# Altium schematic sheet Sensor.SchDoc
size A3; SheetNumber: 15; SheetTotal: 15
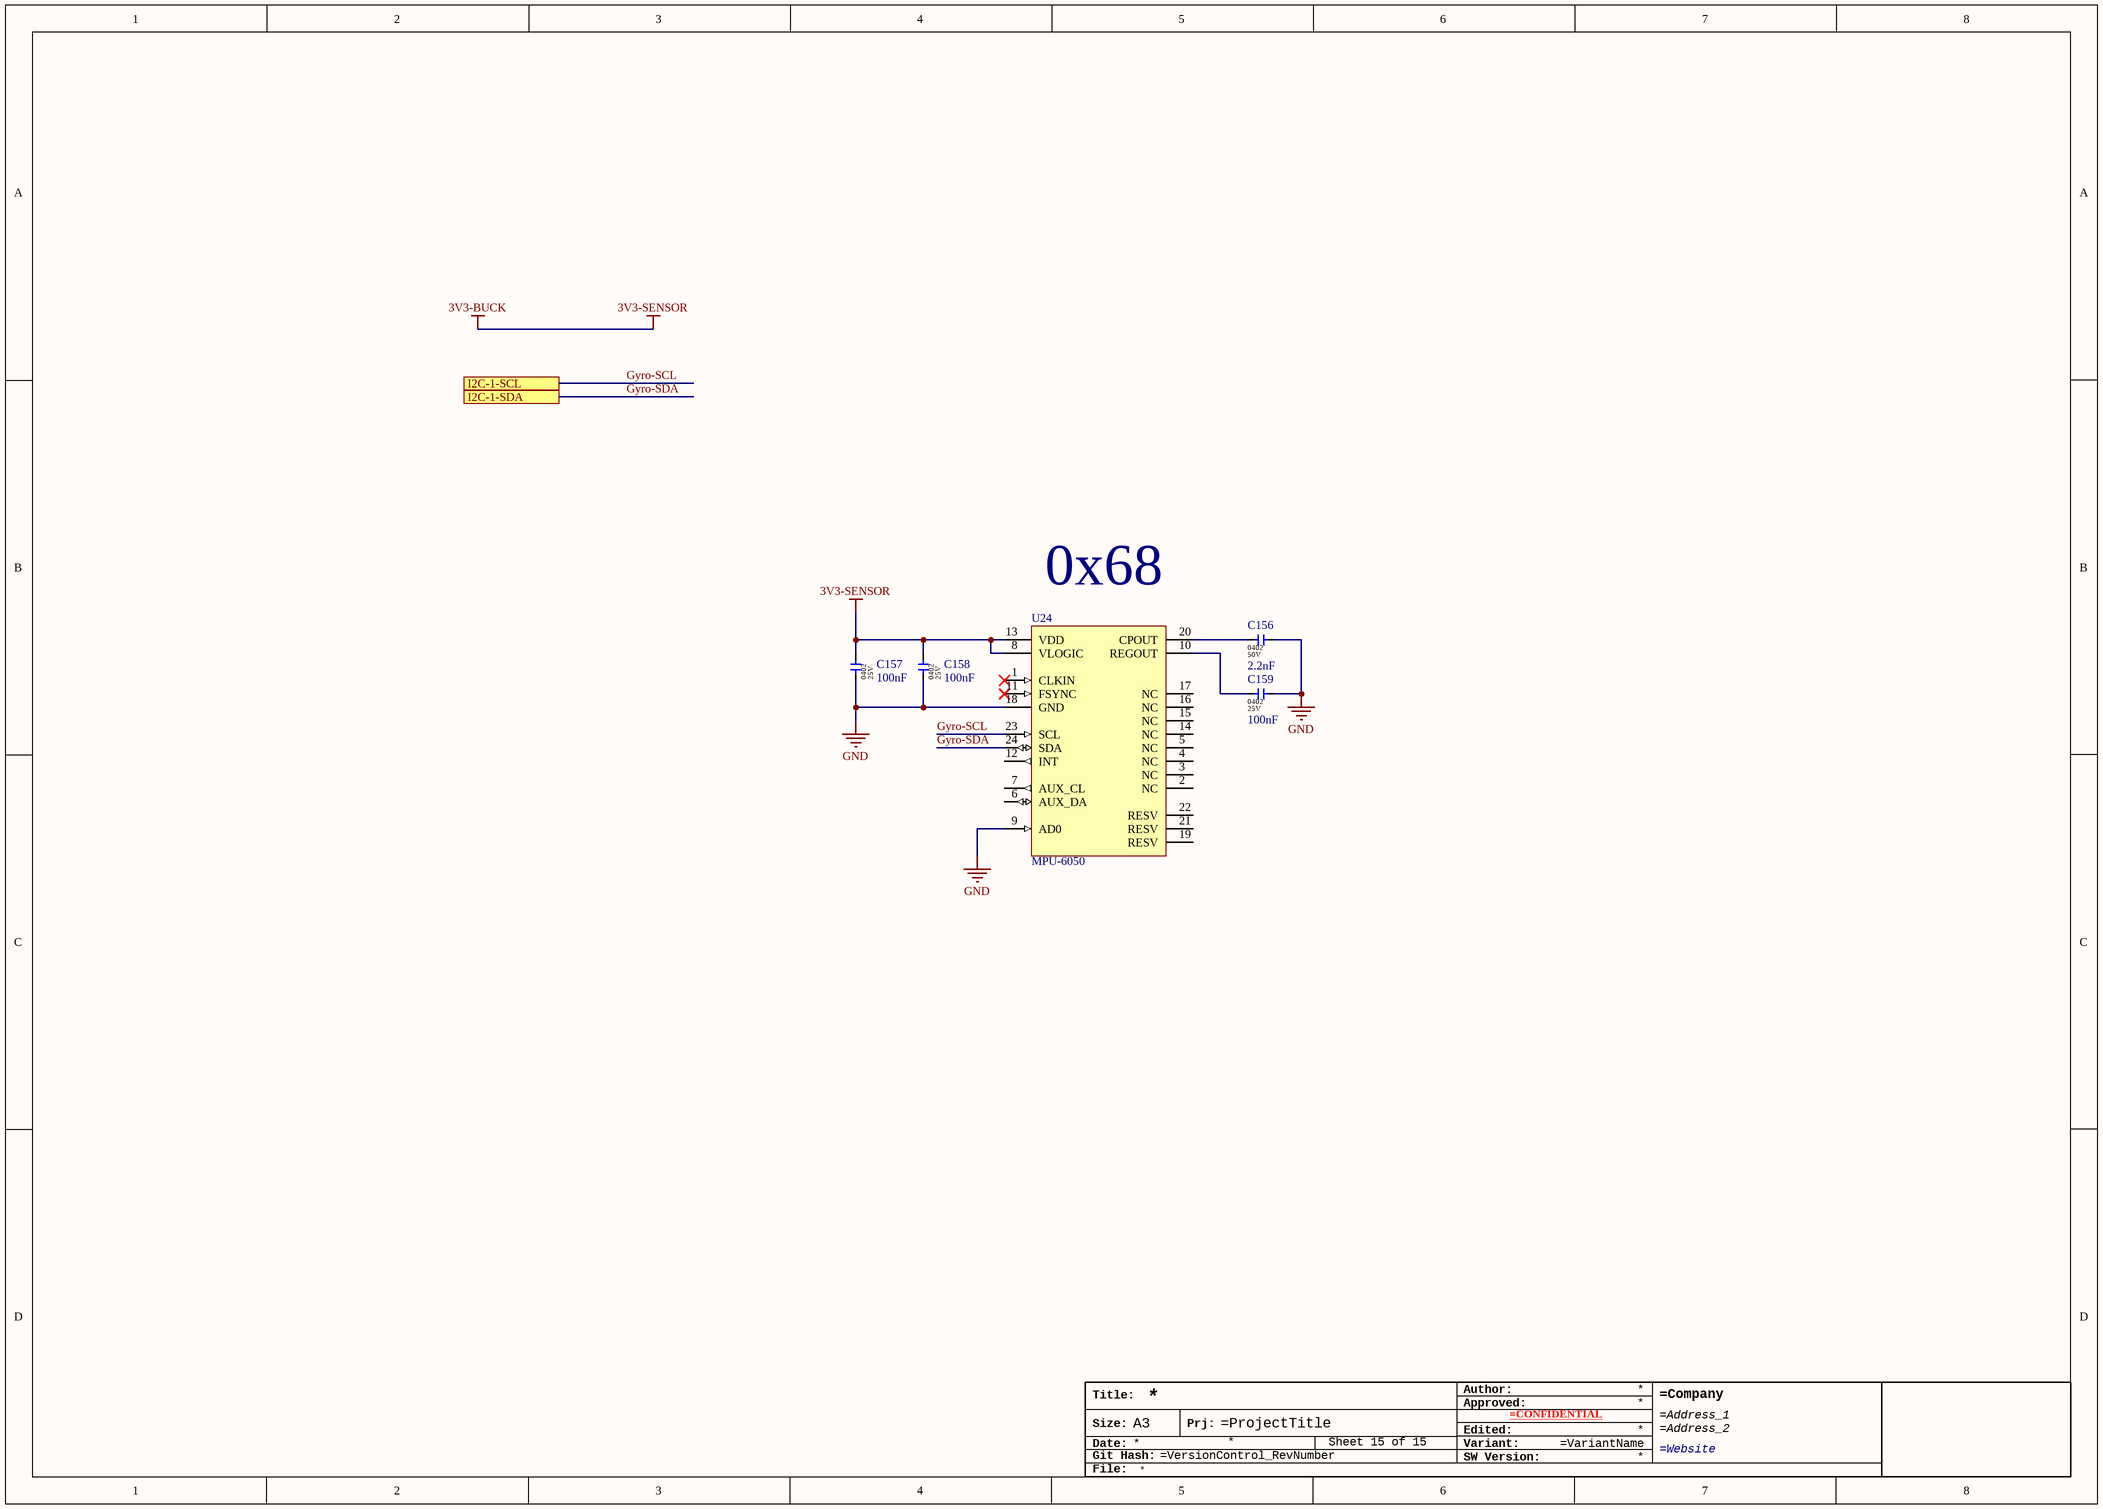
[diagram p0: Sensor.SchDoc]

## Parts
*?  TitleBlock_Generic  (value not drawn)  (graphical)
C156  2.2nF  [CAP-0402]
C157  100nF  [CAP-0402]
C158  100nF  [CAP-0402]
C159  100nF  [CAP-0402]
U24  MPU-6050  [QFN24-4x4MM_PAD]

## Ports
I2C-1-SCL, I2C-1-SDA

## Nets
3V3-BUCK: C157.2 C158.2 U24.8(VLOGIC) U24.13(VDD)  [also labelled 3V3-SENSOR]
GND: C156.2 C157.1 C158.1 C159.2 U24.9(AD0) U24.18(GND)
Gyro-SCL: U24.23(SCL) ; port I2C-1-SCL
Gyro-SDA: U24.24(SDA) ; port I2C-1-SDA
NetC156_1: C156.1 U24.20(CPOUT)
NetC159_1: C159.1 U24.10(REGOUT)

Not connected (* = marked no-connect by the designer): U24 1(CLKIN)* 2(NC) 3(NC) 4(NC) 5(NC) 6(AUX_DA) 7(AUX_CL) 11(FSYNC)* 12(INT) 14(NC) 15(NC) 16(NC) 17(NC) 19(RESV) 21(RESV) 22(RESV)

## Notes on the sheet
- (near U24) 0x68
- (in symbol TitleBlock_Generic) Author:; Title:; Approved:; Size:; A3; Prj:; Edited:; Date:; Variant:; SW Version:; Git Hash:; File:

## Library data of the parts
C156 = 0402B222K500CT: 50V 2.2nF X7R ±10% 0402 Multilayer Ceramic Capacitors MLCC - SMD/SMT ROHS; Manufacture: WALSIN; Package / Case: 0402; Component type: Capacitor; Manufacture part: 0402B222K500CT; Capacitor value: 2.2nF; Voltage: 50V; Package: 0402
C157-C159 = 0402X104K250CT: 100nF ±10% 25V X5R 0402 Multilayer Ceramic Capacitors MLCC - SMD/SMT RoHS; Manufacture: WALSIN; Package / Case: 0402; Component type: Capacitor; Manufacture part: 0402X104K250CT; Capacitor value: 100nF; Voltage: 25V; Package: 0402
U24 = MPU-6050: 6-axis accelerometer/gyroscope; Manufacture: TDK InvenSense; Manufacture part: MPU-6050; Package: QFN-24 (4x4); Datasheet: https://datasheet.lcsc.com/lcsc/1811071024_TDK-InvenSense-MPU-6050_C24112.pdf
*? = TitleBlock_Generic: Manufacture part: TitleBlock_Generic; Manufacture: N/A; Type: Graphic